# EasyEDA Pro project Padauk.eprj

# Schematic Schematic1
Board Name: Board1; Create Date: 2025-11-22; Page Name: P1; Project Name: PMS150C; Schematic Name: Schematic1; Update Date: 2025-11-22; Company: EasyEDA.com; Page Size: A4; Version: V1.0
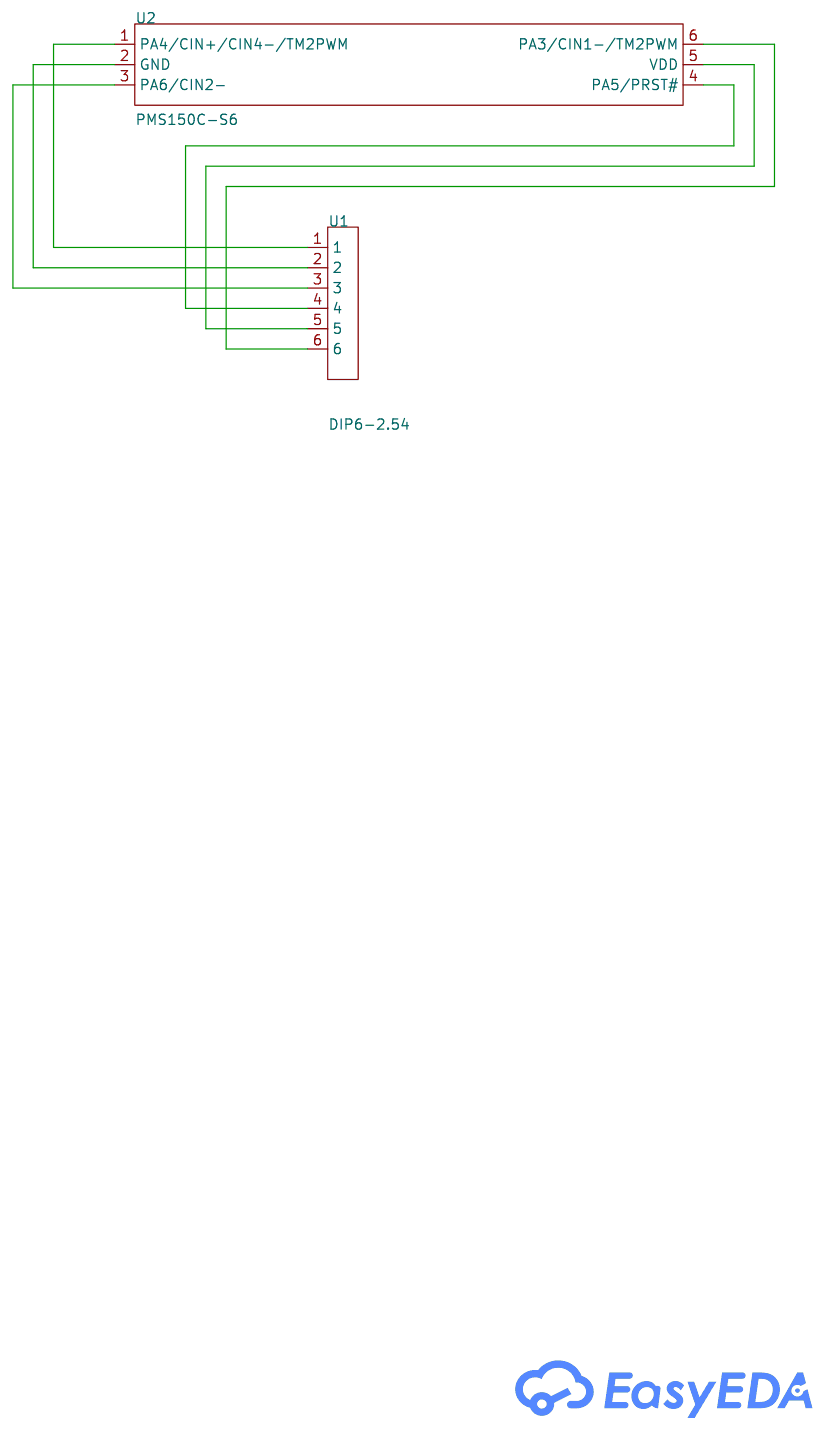
[diagram p0: schematic sheet]

## Parts
U1  DIP6-2.54  [SW-TH_L11.8-W10.3-P2.54_C9900008732]
U2  PMS150C-S6  [SOT-23-6_L2.9-W1.6-P0.95-LS2.8-TL]

## Library data of the parts
U1 = DIP6-2.54: Supplier Part: C9900008732; Supplier Footprint: SWDIP-4; JLCPCB Part Class: Extended Part; Supplier: LCSC
U2 = PMS150C-S6: Supplier Part: C9900003356; Supplier Footprint: SOT-23-6; JLCPCB Part Class: Extended Part; Supplier: LCSC

## Nets
$1N371: U1.1 U2.1(PA4/CIN+/CIN4-/TM2PWM)
$1N386: U1.2 U2.2(GND)
$1N393: U1.3 U2.3(PA6/CIN2-)
$1N419: U1.4 U2.4(PA5/PRST#)
$1N431: U1.5 U2.5(VDD)
$1N444: U1.6 U2.6(PA3/CIN1-/TM2PWM)

# Schematic Schematic2
Board Name: pfs154-s16-adapter; Create Date: 2025-12-14; Page Name: P1; Project Name: Padauk; Schematic Name: Schematic2; Update Date: 2025-12-14; Company: EasyEDA.com; Page Size: A4; Version: V1.0
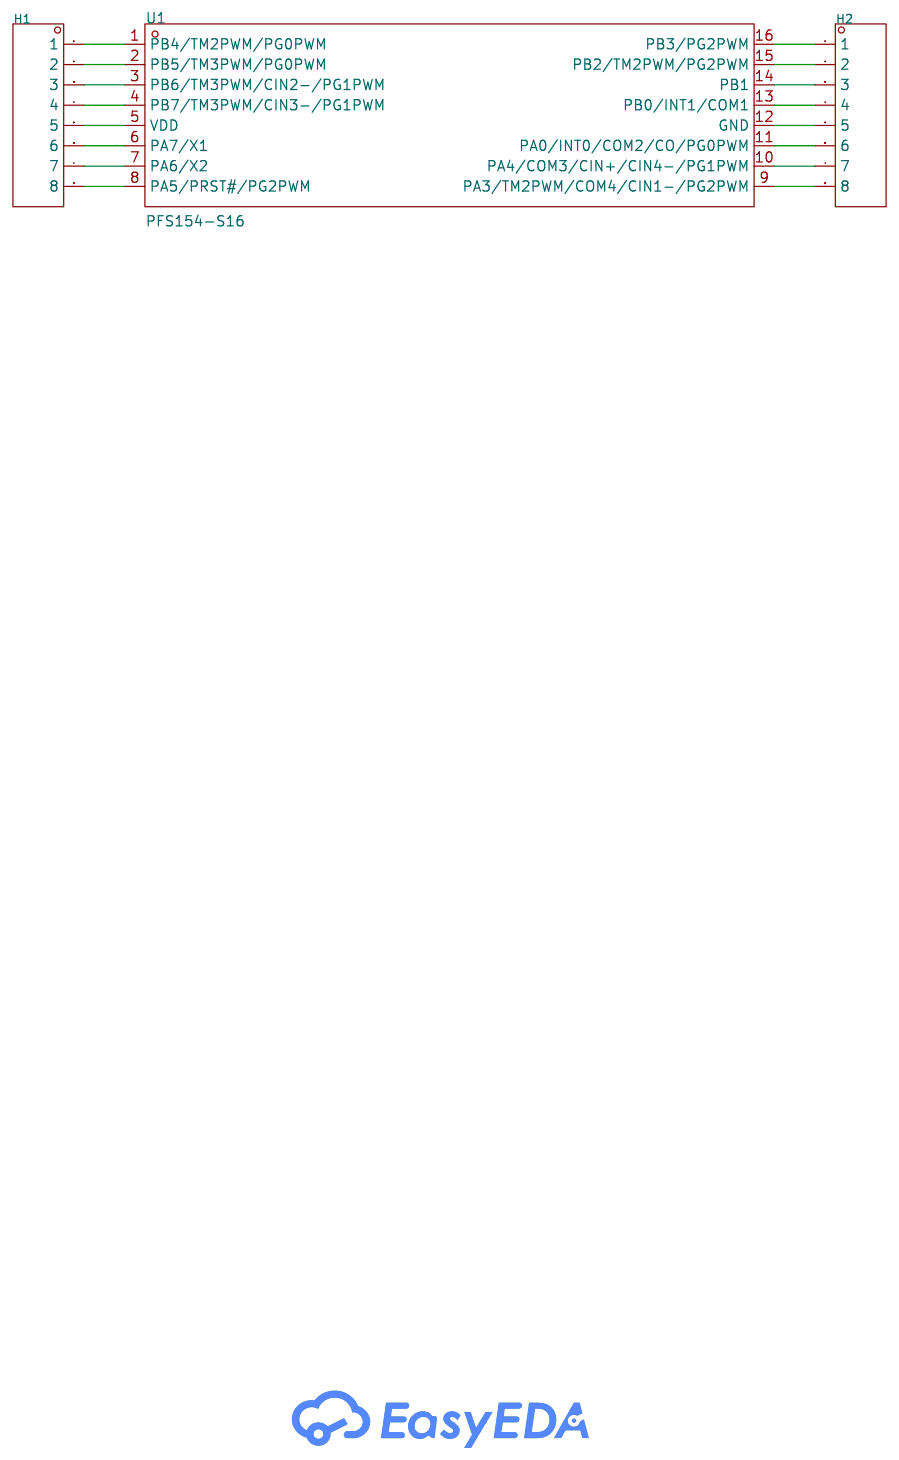
[diagram p1: schematic sheet]

## Parts
H1  -  [HDR-TH_8P-P2.54-V-M]
H2  -  [HDR-TH_8P-P2.54-V-M]
U1  PFS154-S16  [SOP-16_L10.0-W3.9-P1.27-LS6.0-BL]

## Library data of the parts
H1 H2 = HDR-M_2.54_1x8P: Supplier Footprint: Through
U1 = PFS154-S16: LCSC Part Name: 8位多次可编程（MTP）型IO控制器; Supplier Part: C317613; Manufacturer: PADAUK(应广); Supplier Footprint: SOP-16; JLCPCB Part Class: Extended Part; Datasheet: https://item.szlcsc.com/datasheet/PFS154-S16/299191.html; Supplier: LCSC; CPU Core: RISC; Program Storage Size: 2KB; Program Memory Type: FLASH; Number of I/O: 14; PWM (Bit): 11bit; Voltage - Supply: 2V~5.5V

## Nets
$1N503: H1.1 U1.1(PB4/TM2PWM/PG0PWM)
$1N507: H1.2 U1.2(PB5/TM3PWM/PG0PWM)
$1N512: H1.3 U1.3(PB6/TM3PWM/CIN2-/PG1PWM)
$1N517: H1.4 U1.4(PB7/TM3PWM/CIN3-/PG1PWM)
$1N522: H1.5 U1.5(VDD)
$1N527: H1.6 U1.6(PA7/X1)
$1N532: H1.7 U1.7(PA6/X2)
$1N537: H1.8 U1.8(PA5/PRST#/PG2PWM)
$1N542: H2.1 U1.16(PB3/PG2PWM)
$1N547: H2.2 U1.15(PB2/TM2PWM/PG2PWM)
$1N552: H2.3 U1.14(PB1)
$1N557: H2.4 U1.13(PB0/INT1/COM1)
$1N562: H2.5 U1.12(GND)
$1N567: H2.6 U1.11(PA0/INT0/COM2/CO/PG0PWM)
$1N572: H2.7 U1.10(PA4/COM3/CIN+/CIN4-/PG1PWM)
$1N577: H2.8 U1.9(PA3/TM2PWM/COM4/CIN1-/PG2PWM)

# Schematic Schematic3
Board Name: Dip8 Connector; Create Date: 2025-12-14; Page Name: P1; Project Name: Padauk; Schematic Name: Schematic3; Update Date: 2025-12-14; Company: EasyEDA.com; Page Size: A4; Version: V1.0
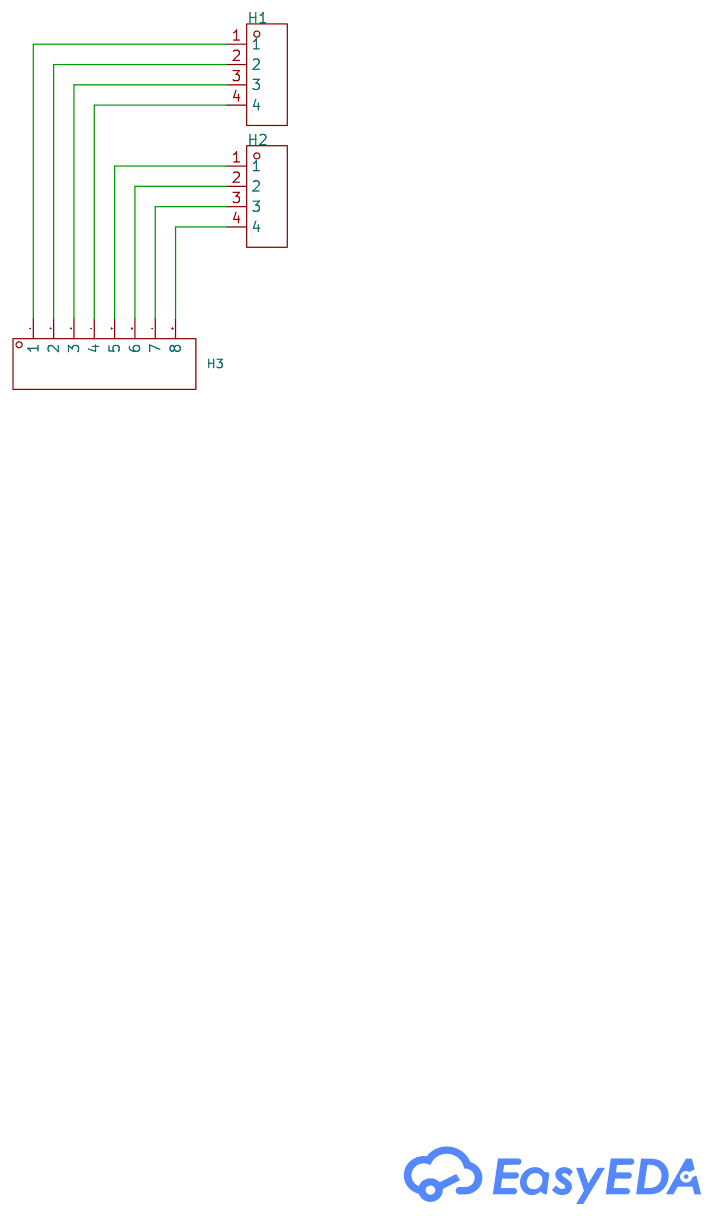
[diagram p2: schematic sheet]

## Parts
H1  -  [HDR-TH_4P-P2.54-V-M]
H2  -  [HDR-TH_4P-P2.54-V-M]
H3  -  [HDR-TH_8P-P2.54-V-M]

## Library data of the parts
H1 H2 = HDR-M_2.54_1x4P: Supplier Footprint: Through
H3 = HDR-M_2.54_1x8P: Supplier Footprint: Through

## Nets
$1N275: H2.1 H3.5
$1N280: H2.2 H3.6
$1N286: H2.3 H3.7
$1N292: H2.4 H3.8
$1N309: H1.1 H3.1
$1N314: H1.2 H3.2
$1N320: H1.3 H3.3
$1N326: H1.4 H3.4

# Schematic PDK Devboard V1
Board Name: PDK Devboard V1; Create Date: 2025-12-14; Page Name: P1; Project Name: Padauk; Schematic Name: PDK Devboard V1; Update Date: 2025-12-17; Company: m039; Drawn: Dmitry Mozgin; Page Size: A4; Version: V1.0
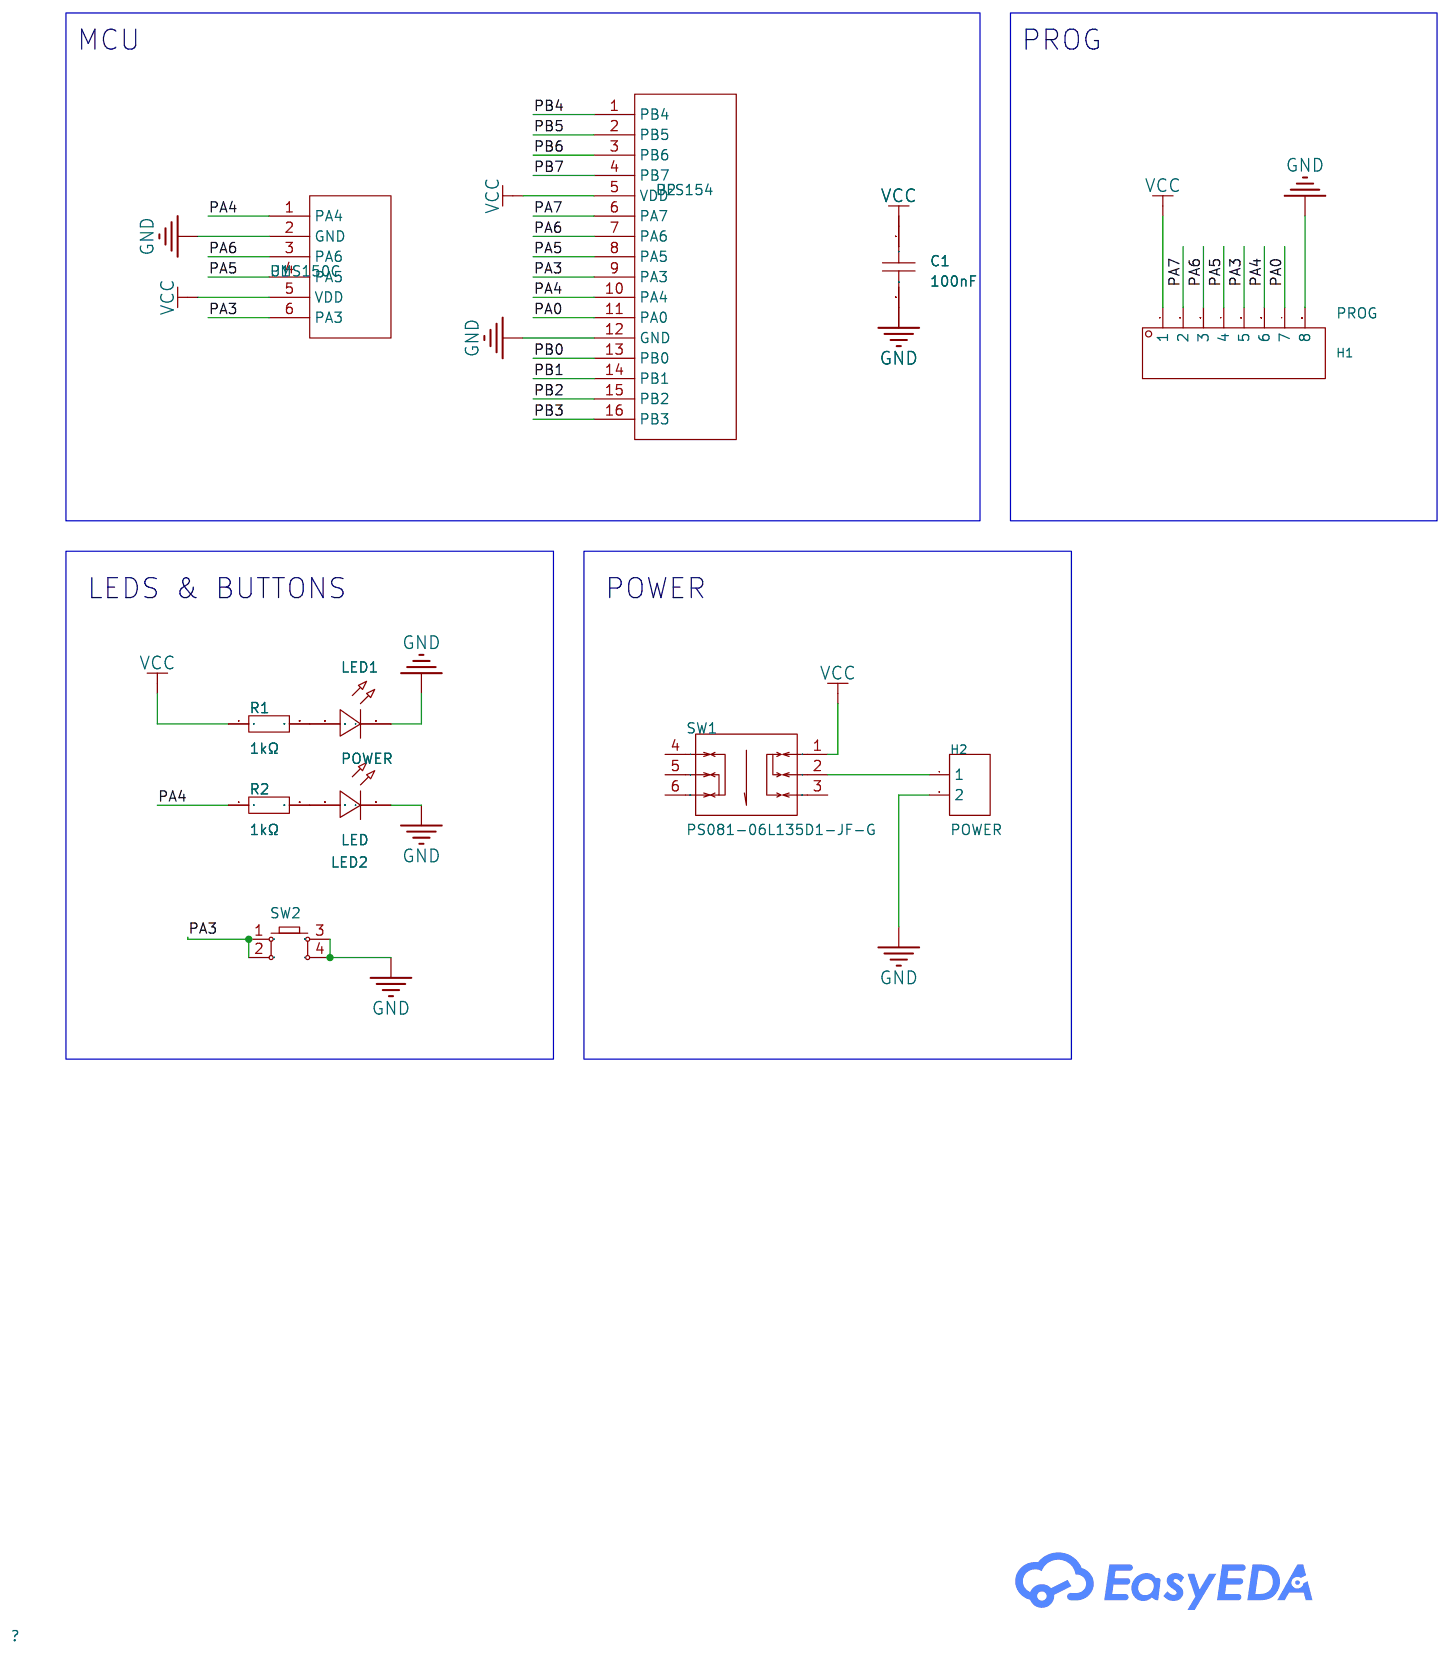
[diagram p3: schematic sheet]

## Parts
C1  100nF  [C0805]
H1  PROG  [HDR-TH_8P-P2.54-V-M]
H2  POWER  [HDR-TH_2P-P2.54-V-F]
LED1  POWER  [LED-TH_BD3.0-P2.54-FD]
LED2  LED  [LED-TH_BD3.0-P2.54-FD]
R1  1kΩ  [R1206]
R2  1kΩ  [R1206]
SW1  PS081-06L135D1-JF-G  [SW-TH_6P-L8.0-W8.0-P2.50-TL]
SW2  -  [KEY-TH_4P-L6.0-W6.0-P3.90-LS6.5]
U1  PMS150C  [PMS150C-U06]
U2  PFS154  [PFS154-S16-A]

## Library data of the parts
C1 = CAP_0805: Supplier Footprint: 0805
H1 = HDR-M_2.54_1x8P: Supplier Footprint: Through
H2 = HDR-F_2.54_1x2P: Supplier Footprint: Through
LED1 = LED_TH-R_3mm: Supplier Footprint: Through
LED2 = LED_TH-G_3mm: Supplier Footprint: Through
R1 R2 = Res_1206: Supplier Footprint: 1206
SW1 = PS081-06L135D1-JF-G: LCSC Part Name: 8x8自锁开关; Supplier Part: C46533676; Manufacturer: Khon(康宏电子); Supplier Footprint: DIP-6P,8x8mm; Datasheet: https://item.szlcsc.com/datasheet/PS081-06L135D1-JF-G/48661190.html; Supplier: LCSC
SW2 = Key_TH_6x6x4.5: Supplier Footprint: Through
U1 = PMS150C-U06
U2 = pfs154-s16-adapter

## Nets
GND: C1.2 H1.8 H2.2 LED1.2(A) LED2.2(A) SW2.3 SW2.4 U1.2(GND) U2.12(GND)
VCC: C1.1 H1.1 R1.1 SW1.1 U1.5(VDD) U2.5(VDD)
PA0: H1.7 U2.11(PA0)
PA3: H1.5 SW2.1 SW2.2 U1.6(PA3) U2.9(PA3)
PA4: H1.6 R2.1 U1.1(PA4) U2.10(PA4)
PA5: H1.4 U1.4(PA5) U2.8(PA5)
PA6: H1.3 U1.3(PA6) U2.7(PA6)
PA7: H1.2 U2.6(PA7)
PB0: U2.13(PB0)
PB1: U2.14(PB1)
PB2: U2.15(PB2)
PB3: U2.16(PB3)
PB4: U2.1(PB4)
PB5: U2.2(PB5)
PB6: U2.3(PB6)
PB7: U2.4(PB7)
$1N1002: LED1.1(C) R1.2
$1N1028: LED2.1(C) R2.2
$1N1956: H2.1 SW1.2

Not connected (* = marked no-connect by the designer): SW1 3 4 5 6

## Notes on the sheet
- MCU
- PROG
- LEDS & BUTTONS
- POWER

# Schematic Schematic5
Board Name: PDK Sound Player; Create Date: 2025-12-18; Page Name: P1; Project Name: Padauk; Schematic Name: Schematic5; Update Date: 2025-12-25; Company: m039; Drawn: Dmitry Mozgin; Page Size: A4; Version: V1.0
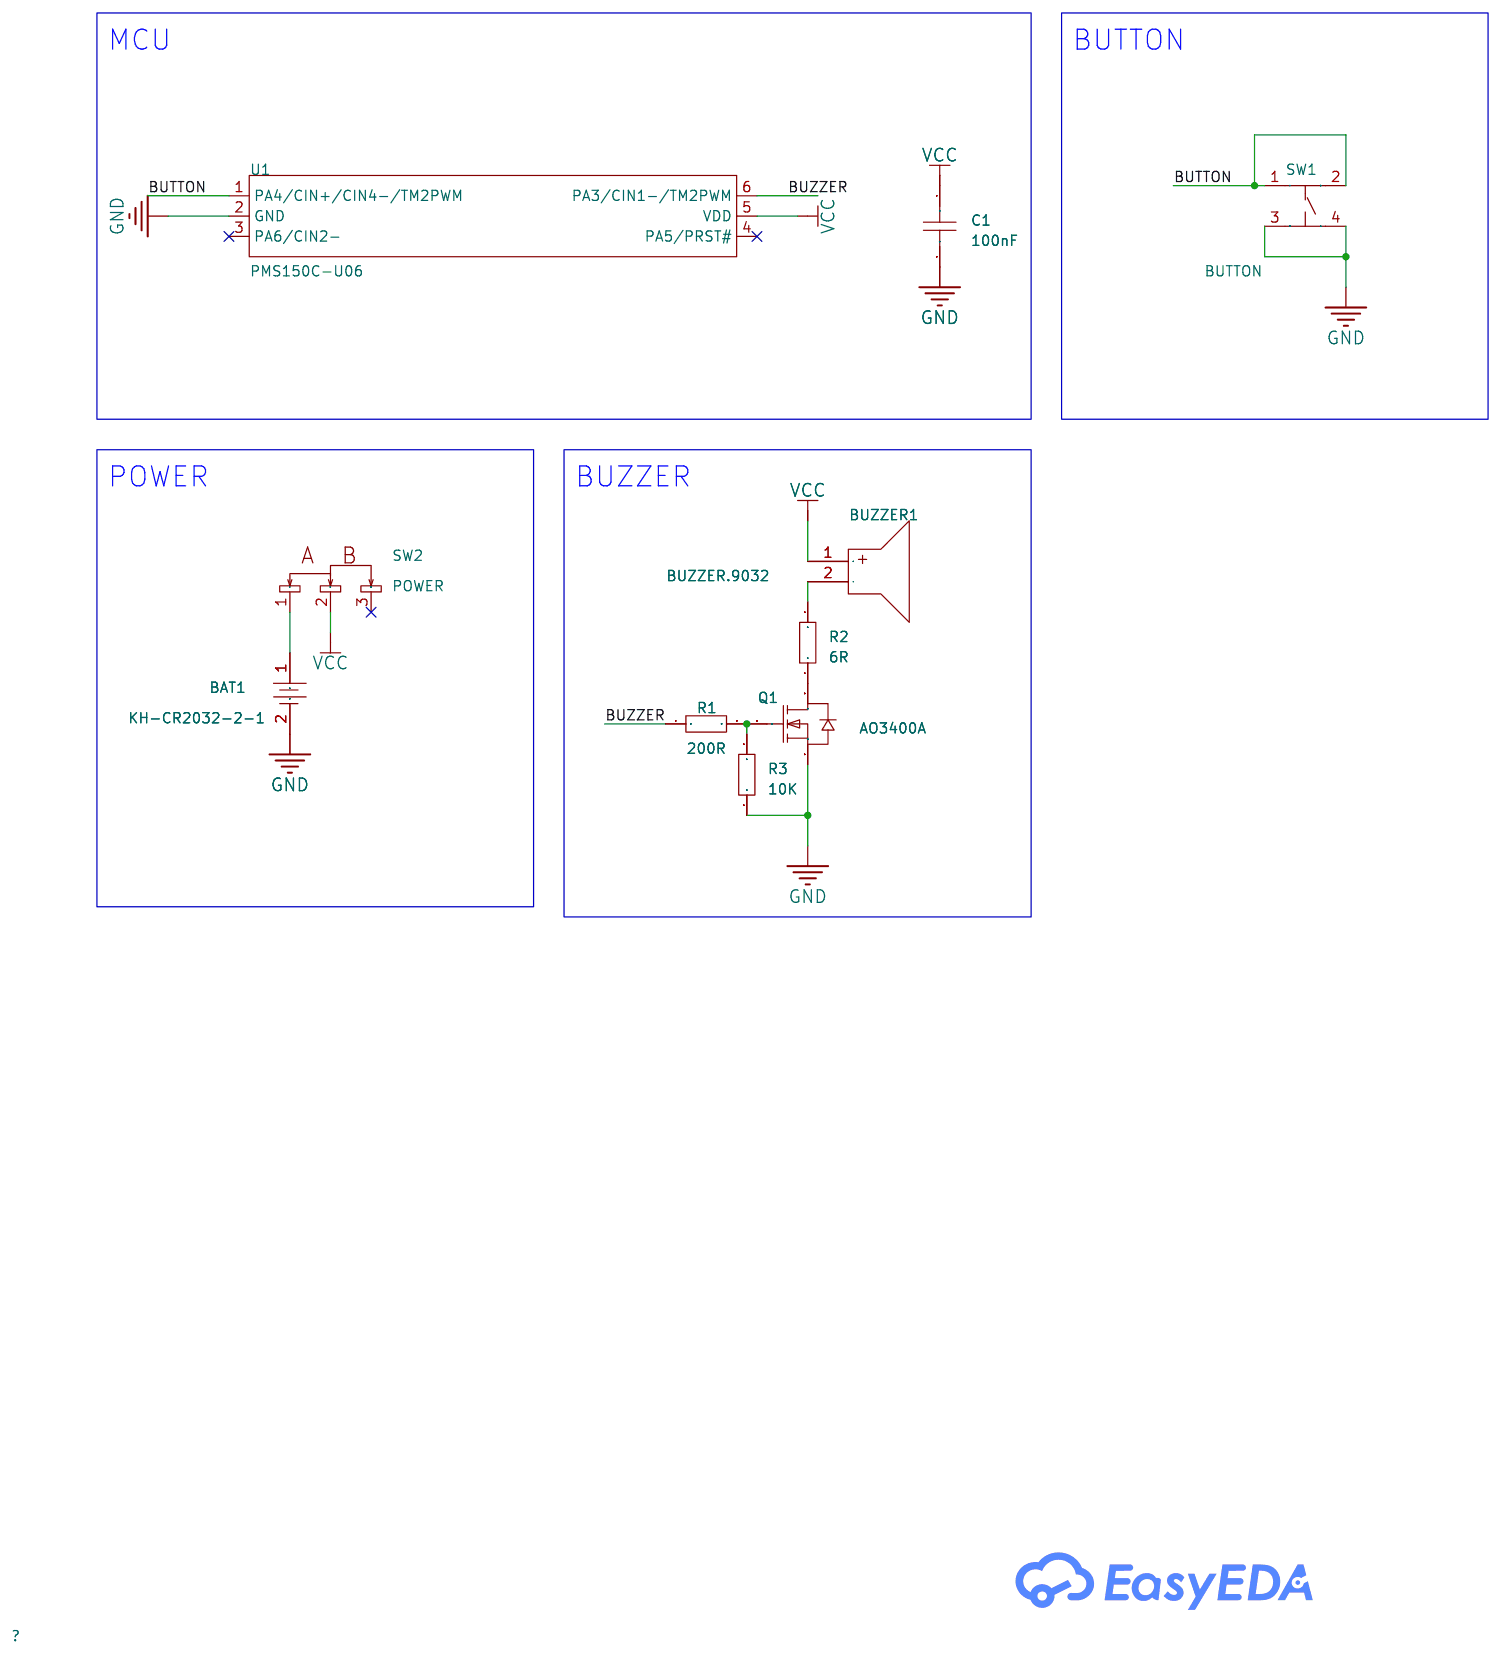
[diagram p4: schematic sheet]

## Parts
BAT1  KH-CR2032-2-1  [BAT-TH_KH-CR2032-2-1]
BUZZER1  BUZZER.9032  [BUZ-SMD_2P-L10.5-W9.0-P10.50-R]
C1  100nF  [C0603]
Q1  AO3400A  [SOT-23-3_L2.9-W1.3-P1.90-LS2.4-BR]
R1  200R  [R0603]
R2  6R  [R0603]
R3  10К  [R0603]
SW1  BUTTON  [SW-SMD_4P-L6.0-W6.0-P4.50-LS9.0_KH-6X6X6H-STM]
SW2  POWER  [MSS-22D18/MSS22D18]
U1  PMS150C-U06  [SOT-23-6_L2.9-W1.6-P0.95-LS2.8-BR]

## Library data of the parts
BAT1 = KH-CR2032-2-1: Supplier Part: C5365915; Manufacturer: kinghelm(金航标); JLCPCB Part Class: Extended Part; Datasheet: https://atta.szlcsc.com/upload/public/pdf/source/20230301/F3ED62C53898C1F99BC47B7A2E148BA2.pdf; Supplier: LCSC
BUZZER1 = BUZZER.9032: Supplier Part: C9900002564; Supplier Footprint: SMD; JLCPCB Part Class: Extended Part; Supplier: LCSC
C1 = CAP_0603: Supplier Footprint: 0603
Q1 = AO3400A_C20917: LCSC Part Name: 1个N沟道 耐压:30V 电流:5.7A; Supplier Part: C20917; Manufacturer: AOS; Supplier Footprint: SOT-23-3L; JLCPCB Part Class: Basic Part; Datasheet: https://item.szlcsc.com/datasheet/AO3400A/21629.html; Supplier: LCSC; Drain to Source Voltage: 30V; RDS(on): 48mΩ@2.5V; Gate Threshold Voltage (Vgs(th)): 1.45V@250uA; Gate Charge(Qg): 7nC@10V; Input Capacitance(Ciss): 630pF@15V; Operating Temperature: -55℃~+150℃@(Tj); Type: N-Channel
R1-R3 = Res_0603: Supplier Footprint: 0603
SW1 = KH-6X6X6H-STM: LCSC Part Name: 6*6*6mm 立贴 轻触开关; Supplier Part: C2837532; Manufacturer: kinghelm(金航标); Supplier Footprint: SMD-4P,6x6mm; JLCPCB Part Class: Extended Part; Datasheet: https://item.szlcsc.com/datasheet/KH-6X6X6H-STM/3009602.html; Supplier: LCSC; Circuit: SPST; Actuator Style: Round Button; Mounting Type: Surface Mount,Vertical; Length: 6mm; Width: 6mm; Switch Height: 6mm; with Bracket: Without Bracket; Contact Current: 50mA; Voltage Rating: 12V; Actuator/Cap Color: Black; Termination Style: Gull Wing; Life: 80,000 Cycles
SW2 = MSS22D18: Supplier Part: C9900190765; Supplier Footprint: 插件; JLCPCB Part Class: Extended Part; Supplier: LCSC
U1 = PMS150C-U06: LCSC Part Name: 8位一次性可编程（OTP）型IO控制器; Supplier Part: C168658; Manufacturer: PADAUK(应广); Supplier Footprint: SOT-23-6; JLCPCB Part Class: Extended Part; Datasheet: https://item.szlcsc.com/datasheet/PMS150C-U06/180041.html; Supplier: LCSC; CPU Core: RISC; Program Storage Size: 1KB; Program Memory Type: OTP; Voltage - Supply: 2V~5.5V

## Nets
GND: BAT1.2 C1.2 Q1.2(S) R3.1 SW1.3(C) SW1.4(D) U1.2(GND)
VCC: BUZZER1.1(+) C1.1 SW2.2 U1.5(VDD)
BUTTON: SW1.1(A) SW1.2(B) U1.1(PA4/CIN+/CIN4-/TM2PWM)
BUZZER: R1.1 U1.6(PA3/CIN1-/TM2PWM)
$1N702: Q1.1(G) R1.2 R3.2
$1N728: Q1.3(D) R2.1
$1N730: BUZZER1.2(-) R2.2
$1N951: BAT1.1 SW2.1

Not connected (* = marked no-connect by the designer): SW2 3*; U1 3(PA6/CIN2-)* 4(PA5/PRST#)*

## Notes on the sheet
- MCU
- BUTTON
- POWER
- BUZZER

# Schematic Schematic2_1
Board Name: pfs122-s16-adapter; Create Date: 2025-12-18; Page Name: P1; Project Name: Padauk; Schematic Name: Schematic2_1; Update Date: 2025-12-19; Company: EasyEDA.com; Page Size: A4; Version: V1.0
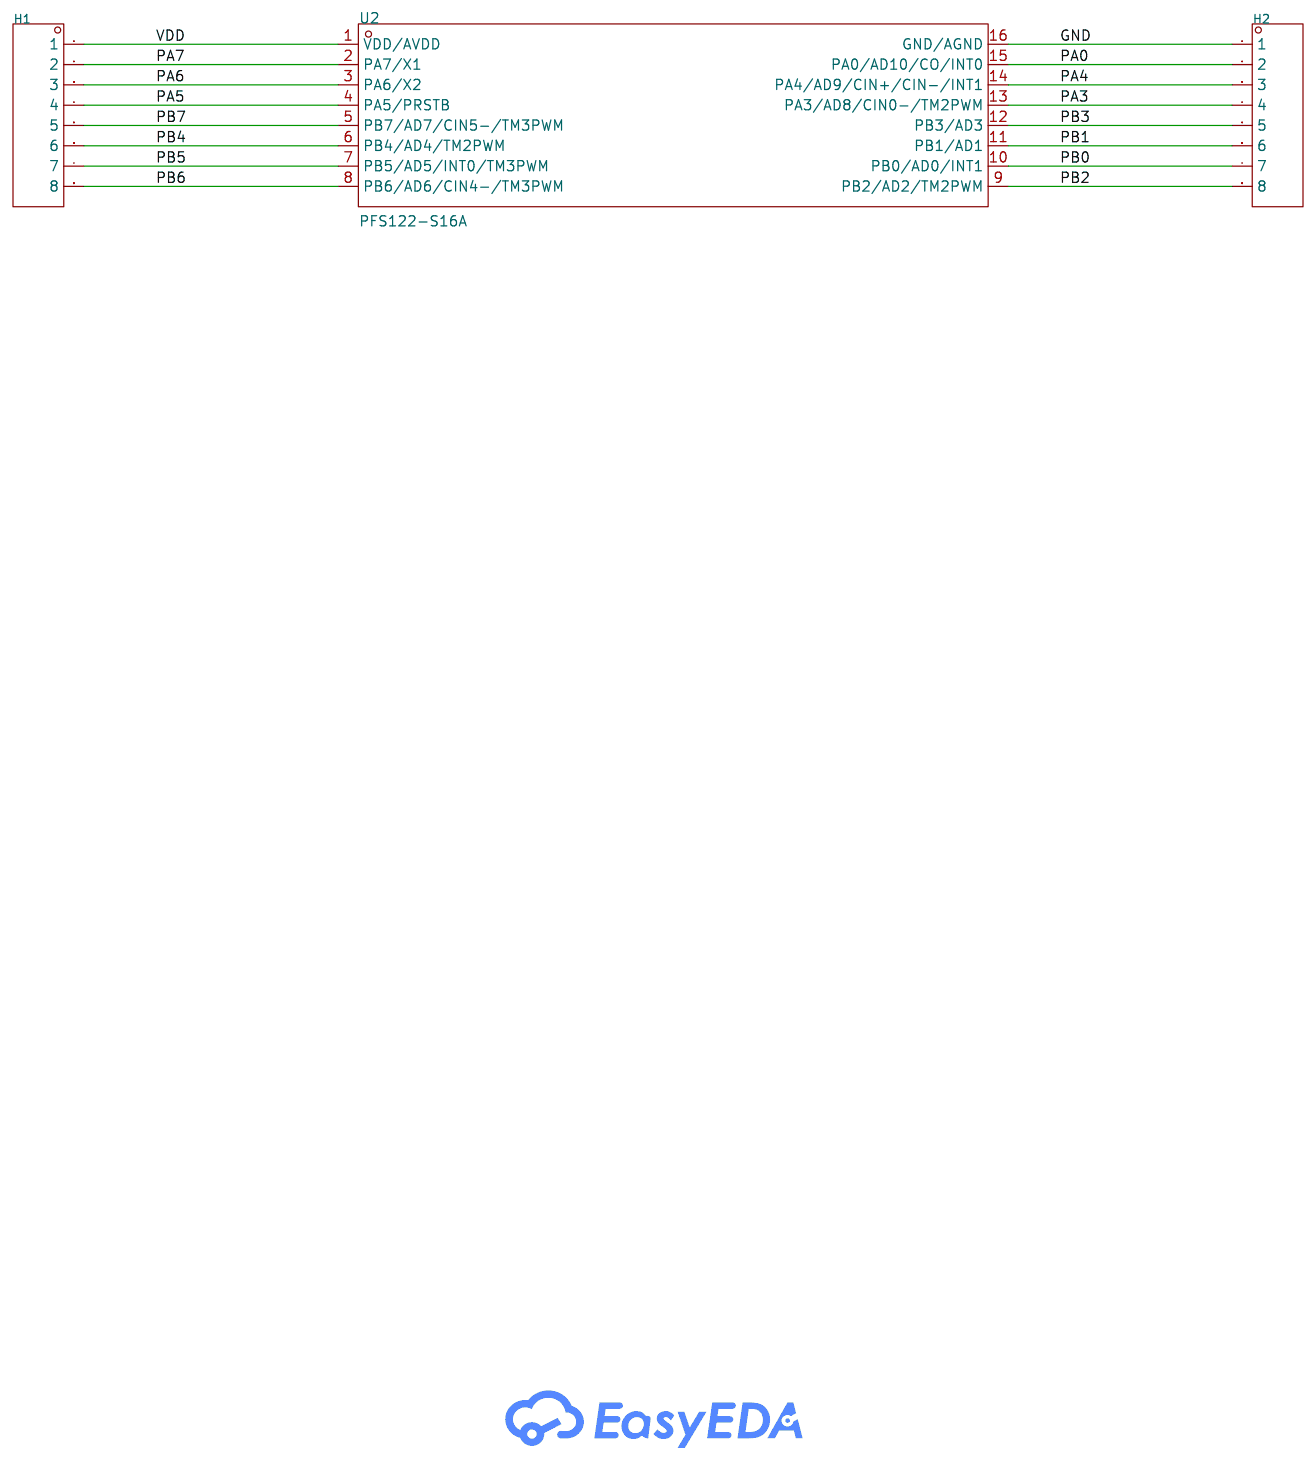
[diagram p5: schematic sheet]

## Parts
H1  -  [HDR-TH_8P-P2.54-V-M]
H2  -  [HDR-TH_8P-P2.54-V-M]
U2  PFS122-S16A  [SOIC-16_L9.9-W3.9-P1.27-LS6.0-BL]

## Library data of the parts
H1 H2 = HDR-M_2.54_1x8P: Supplier Footprint: Through
U2 = PFS122-S16A: Supplier Part: C3646912; Manufacturer: PADAUK(应广); Supplier Footprint: SOP-16-150mil; JLCPCB Part Class: Extended Part; Datasheet: https://atta.szlcsc.com/upload/public/pdf/source/20220825/C2F7EA01E0BE731B45B3F2DB09E17873.pdf; Supplier: LCSC

## Nets
GND: H2.1 U2.16(GND/AGND)
VDD: H1.1 U2.1(VDD/AVDD)
PA0: H2.2 U2.15(PA0/AD10/CO/INT0)
PA3: H2.4 U2.13(PA3/AD8/CIN0-/TM2PWM)
PA4: H2.3 U2.14(PA4/AD9/CIN+/CIN-/INT1)
PA5: H1.4 U2.4(PA5/PRSTB)
PA6: H1.3 U2.3(PA6/X2)
PA7: H1.2 U2.2(PA7/X1)
PB0: H2.7 U2.10(PB0/AD0/INT1)
PB1: H2.6 U2.11(PB1/AD1)
PB2: H2.8 U2.9(PB2/AD2/TM2PWM)
PB3: H2.5 U2.12(PB3/AD3)
PB4: H1.6 U2.6(PB4/AD4/TM2PWM)
PB5: H1.7 U2.7(PB5/AD5/INT0/TM3PWM)
PB6: H1.8 U2.8(PB6/AD6/CIN4-/TM3PWM)
PB7: H1.5 U2.5(PB7/AD7/CIN5-/TM3PWM)

# Board PCB1
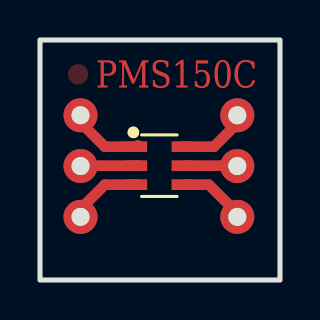
[diagram p6: board, top side]
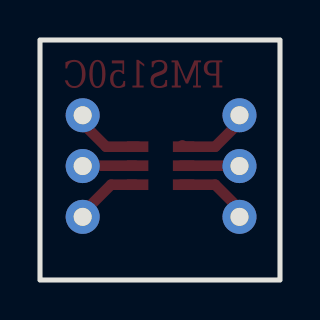
[diagram p7: board, bottom side, seen from below]

Outline 12 x 12 mm; copper layers: Top Layer, Bottom Layer. Coordinates in mm from the lower left corner of the outline.
Outline path: rectangle 0,12 12,0
Stack: Top Layer 0.035mm / Dielectric1 1.51mm FR4 er 4.5 / Bottom Layer 0.035mm

## Design rules (mm)
template: Custom Config
spacing copperThickness1oz (default): track to track 0.27, other pairs 0.152 to 0.3
spacing copperThickness2oz: track to track 0.203, other pairs 0.152 to 0.3
track width copperThickness1oz (default): min 0.127, default 0.532, max 2.54
track width copperThickness2oz: min 0.203, default 0.254, max 2.54
differential pair differentialPair (default): width min 0.127, default 0.254, max 2.54; gap min 0.152, default 0.152
via viaSize (default): diameter min 0.5, default 0.61, max 10; hole min 0.3, default 0.305, max 6.3

## Placement (name value [footprint] x y rotation side)
U1  DIP6-2.54  [SW-TH_L11.8-W10.3-P2.54_C9900008732]  5.84 5.59 0 top
U2  PMS150C-S6  [SOT-23-6_L2.9-W1.6-P0.95-LS2.8-TL]  5.97 5.72 0 top

## Footprints (pads in the part's own frame, mm; a bottom-side part is the same pattern mirrored in y, then rotated)
SOT-23-6_L2.9-W1.6-P0.95-LS2.8-TL
  rect 1.072x0.532 smd: 1(-1.149,0.95) 2(-1.149,0) 3(-1.149,-0.95) 4(1.149,-0.95) 5(1.149,0) 6(1.149,0.95)
SW-TH_L11.8-W10.3-P2.54_C9900008732
  round 1.7 hole 0.9: 1(-3.816,2.649) 2(-3.816,0.109) 3(-3.816,-2.431) 4(4.024,-2.431) 5(4.024,0.109) 6(4.024,2.649)

## Nets
As in the schematic.

## Routing (per net, layer and track width the routed paths; a pad name or vN(x,y) marks a point on that pad's centre or on a via; arc(x,y) is an arc through that point)
$1N371: length 3.7
  Top Layer w0.532: U1.1 2.03,7.88 3.24,6.67 U2.1 ; 4.88,6.73 4.95,6.67
$1N386: length 2.9
  Top Layer w0.532: 4.95,5.72 2.04,5.72 U1.2
$1N393: length 3.8
  Top Layer w0.532: U1.3 2.03,3.55 3.24,4.77 4.95,4.77
$1N419: length 3.4
  Top Layer w0.532: 7.25,4.77 8.44,4.77 9.87,3.34 U1.4
$1N431: length 2.6
  Top Layer w0.532: 7.25,5.72 9.85,5.72 U1.5
$1N444: length 3.6
  Top Layer w0.532: U2.6 8.7,6.67 9.87,7.83 U1.6

## Copper pours and planes (outline as drawn; the poured copper is in the pictures)
(no net) on Top Layer: 1.4,10.79 2.41,10.79 2.41,9.78 1.4,9.78

## Text on the board
Top Layer: PMS150C

# Board PCB2
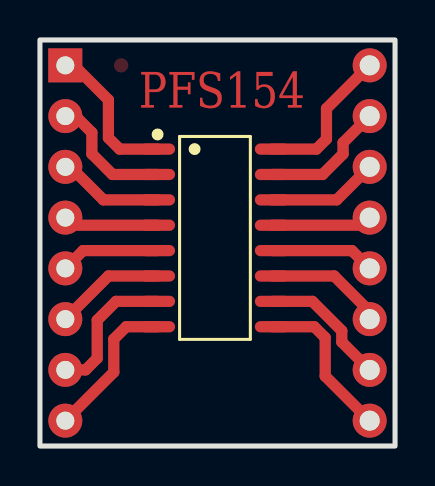
[diagram p8: board, top side]
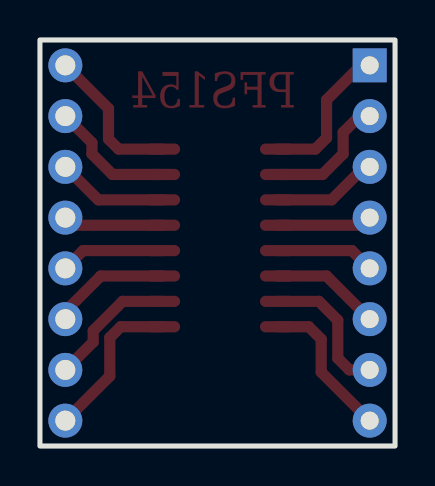
[diagram p9: board, bottom side, seen from below]

Outline 17.78 x 20.32 mm; copper layers: Top Layer, Bottom Layer. Coordinates in mm from the lower left corner of the outline.
Outline path: rectangle 0,20.32 17.78,0
Stack: Top Layer 0.035mm / Dielectric1 1.51mm FR4 er 4.5 / Bottom Layer 0.035mm

## Design rules (mm)
template: Custom Config
spacing copperThickness1oz (default): track to track 0.27, other pairs 0.152 to 0.3
spacing copperThickness2oz: track to track 0.203, other pairs 0.152 to 0.3
track width copperThickness1oz (default): min 0.127, default 0.56, max 2.54
track width copperThickness2oz: min 0.203, default 0.254, max 2.54
differential pair differentialPair (default): width min 0.127, default 0.254, max 2.54; gap min 0.152, default 0.152
via viaSize (default): diameter min 0.5, default 0.61, max 10; hole min 0.3, default 0.305, max 6.3

## Placement (name value [footprint] x y rotation side)
H1  -  [HDR-TH_8P-P2.54-V-M#2]  1.27 10.16 270 top
H2  -  [HDR-TH_8P-P2.54-V-M]  16.51 10.16 270 top
U1  PFS154-S16  [SOP-16_L10.0-W3.9-P1.27-LS6.0-BL]  8.76 10.41 270 top

## Footprints (pads in the part's own frame, mm; a bottom-side part is the same pattern mirrored in y, then rotated)
HDR-TH_8P-P2.54-V-M
  round 1.7 hole 1x0.9: 1(-8.89,0) 2(-6.35,0) 3(-3.81,0) 4(-1.27,0) 5(1.27,0) 6(3.81,0) 7(6.35,0) 8(8.89,0)
HDR-TH_8P-P2.54-V-M#2
  rect 1.7x1.7 hole 0.9: 1(-8.89,0)
  round 1.7 hole 0.9: 2(-6.35,0) 3(-3.81,0) 4(-1.27,0) 5(1.27,0) 6(3.81,0) 7(6.35,0) 8(8.89,0)
SOP-16_L10.0-W3.9-P1.27-LS6.0-BL
  oval 0.56x1.745 smd: 1(-4.445,-2.873) 2(-3.175,-2.873) 3(-1.905,-2.873) 4(-0.635,-2.873) 5(0.635,-2.873) 6(1.905,-2.873) 7(3.175,-2.873) 8(4.445,-2.873) 9(4.445,2.873) 10(3.175,2.873) 11(1.905,2.873) 12(0.635,2.873) 13(-0.635,2.873) 14(-1.905,2.873) 15(-3.175,2.873) 16(-4.445,2.873)

## Nets
As in the schematic.

## Routing (per net, layer and track width the routed paths; a pad name or vN(x,y) marks a point on that pad's centre or on a via; arc(x,y) is an arc through that point)
$1N503: length 7.5
  Top Layer w0.56: H1.1 1.7,19.05 3.43,17.32 3.43,15.42 3.99,14.86 U1.1
$1N507: length 6.5
  Top Layer w0.56: U1.2 3.63,13.59 2.6,14.62 2.6,15.69 1.78,16.51 H1.2
$1N512: length 5.3
  Top Layer w0.56: 1.27,13.97 1.52,13.97 3.17,12.32 U1.3
$1N517: length 4.8
  Top Layer w0.56: H1.4 1.65,11.05 U1.4
$1N522: length 5
  Top Layer w0.56: 1.27,8.89 2.16,9.78 U1.5
$1N527: length 5.5
  Top Layer w0.56: U1.6 3.43,8.51 H1.6
$1N532: length 7.2
  Top Layer w0.56: 1.27,3.81 2.29,3.81 2.87,4.39 2.87,6.3 3.81,7.24 U1.7
$1N537: length 7.5
  Top Layer w0.56: U1.8 4.32,5.97 3.7,5.35 3.7,3.7 H1.8
$1N542: length 7.5
  Top Layer w0.56: U1.16 13.84,14.86 14.35,15.36 14.35,16.89 H2.1
$1N547: length 6.4
  Top Layer w0.56: U1.15 14.15,13.59 15.18,14.62 15.18,15.18 H2.2
$1N552: length 5.6
  Top Layer w0.56: U1.14 14.86,12.32 16.51,13.97
$1N557: length 5
  Top Layer w0.56: U1.13 16.13,11.05 H2.4
$1N562: length 5.2
  Top Layer w0.56: 16.51,8.89 15.62,9.78 U1.12
$1N567: length 6
  Top Layer w0.56: H2.6 16.51,6.73 14.73,8.51 U1.11
$1N572: length 6.6
  Top Layer w0.56: U1.10 13.64,7.24 15.11,5.77 15.11,5.21 16.51,3.81
$1N577: length 7.9
  Top Layer w0.56: H2.8 14.28,3.5 14.28,5.42 13.74,5.97 U1.9

Small or netless copper shapes (teardrops, artwork), in the pictures only: 1 on Top Layer

## Text on the board
Top Layer: PFS154

# Board PCB3
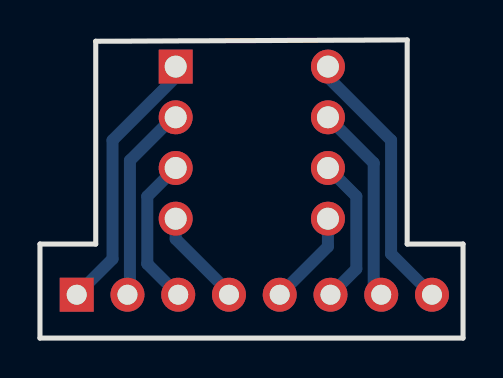
[diagram p10: board, top side]
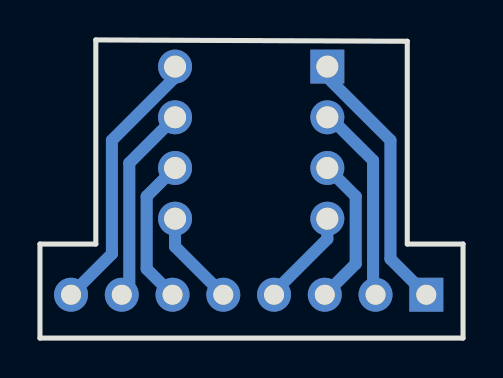
[diagram p11: board, bottom side, seen from below]

Outline 21.17 x 14.94 mm; copper layers: Top Layer, Bottom Layer. Coordinates in mm from the lower left corner of the outline.
Outline path: 0,4.71 0,0 21.17,0 21.17,4.71 18.38,4.71 18.38,14.94 2.79,14.87 2.79,4.71 0,4.71
Stack: Top Layer 0.035mm / Dielectric1 1.51mm FR4 er 4.5 / Bottom Layer 0.035mm

## Design rules (mm)
template: Custom Config
spacing copperThickness1oz (default): track to track 0.27, other pairs 0.152 to 0.3
spacing copperThickness2oz: track to track 0.203, other pairs 0.152 to 0.3
track width copperThickness1oz (default): min 0.127, default 0.6, max 2.54
track width copperThickness2oz: min 0.203, default 0.254, max 2.54
differential pair differentialPair (default): width min 0.127, default 0.254, max 2.54; gap min 0.152, default 0.152
via viaSize (default): diameter min 0.5, default 0.61, max 10; hole min 0.3, default 0.305, max 6.3

## Placement (name value [footprint] x y rotation side)
H1  -  [HDR-TH_4P-P2.54-V-M#2]  6.79 9.79 270 bottom
H2  -  [HDR-TH_4P-P2.54-V-M]  14.41 9.79 90 bottom
H3  -  [HDR-TH_8P-P2.54-V-M]  10.73 2.17 0 top

## Footprints (pads in the part's own frame, mm; a bottom-side part is the same pattern mirrored in y, then rotated)
HDR-TH_4P-P2.54-V-M
  round 1.7 hole 1.1x0.9: 1(-3.81,0) 2(-1.27,0) 3(1.27,0) 4(3.81,0)
HDR-TH_4P-P2.54-V-M#2
  rect 1.7x1.7 hole 1.1x0.9: 1(-3.81,0)
  round 1.7 hole 1.1x0.9: 2(-1.27,0) 3(1.27,0) 4(3.81,0)
HDR-TH_8P-P2.54-V-M
  rect 1.7x1.7 hole 1x0.9: 1(-8.89,0)
  round 1.7 hole 1x0.9: 2(-6.35,0) 3(-3.81,0) 4(-1.27,0) 5(1.27,0) 6(3.81,0) 7(6.35,0) 8(8.89,0)

## Nets
As in the schematic.

## Routing (per net, layer and track width the routed paths; a pad name or vN(x,y) marks a point on that pad's centre or on a via; arc(x,y) is an arc through that point)
$1N275: length 4.8
  Bottom Layer w0.6: H2.1 14.41,4.58 H3.5
$1N280: length 7.5
  Bottom Layer w0.6: H2.2 15.83,7.1 15.83,3.47 H3.6
$1N286: length 10
  Bottom Layer w0.6: H3.7 16.7,2.55 16.7,8.77 H2.3
$1N292: length 13.6
  Bottom Layer w0.6: H3.8 17.57,4.22 17.57,9.91 14.41,13.07 H2.4
$1N309: length 13.5
  Bottom Layer w0.6: H1.1 6.79,13.07 3.63,9.91 3.63,3.97 H3.1
$1N314: length 10
  Bottom Layer w0.6: H1.2 6.66,11.06 4.5,8.9 4.5,2.3 H3.2
$1N320: length 7.6
  Bottom Layer w0.6: H1.3 5.37,7.1 5.37,3.72 H3.3
$1N326: length 4.9
  Bottom Layer w0.6: H1.4 6.79,4.97 9.46,2.3 H3.4

# Board PCB4
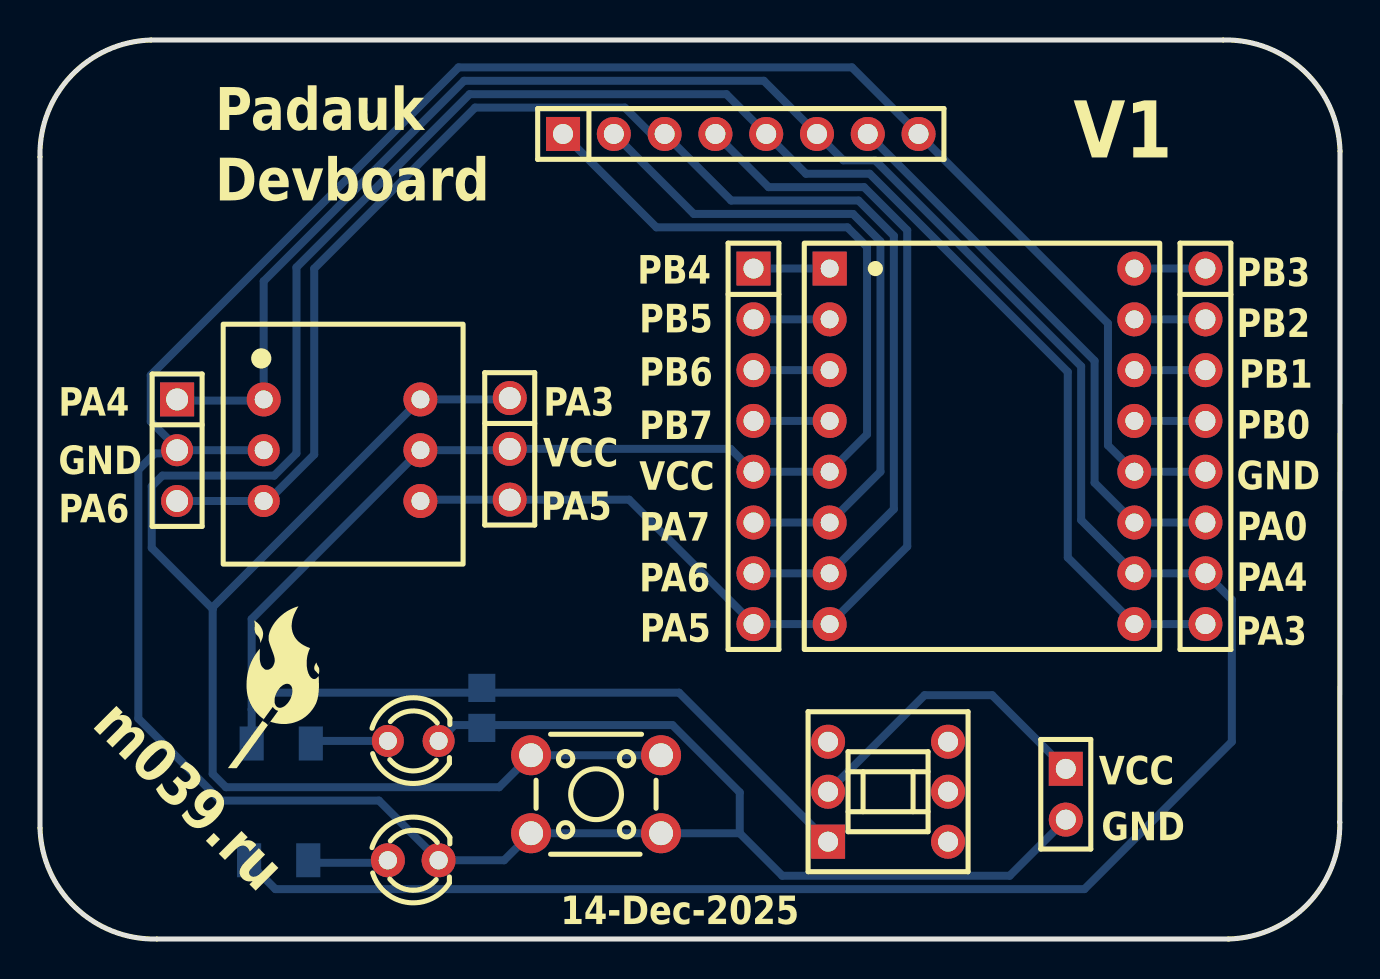
[diagram p12: board, top side]
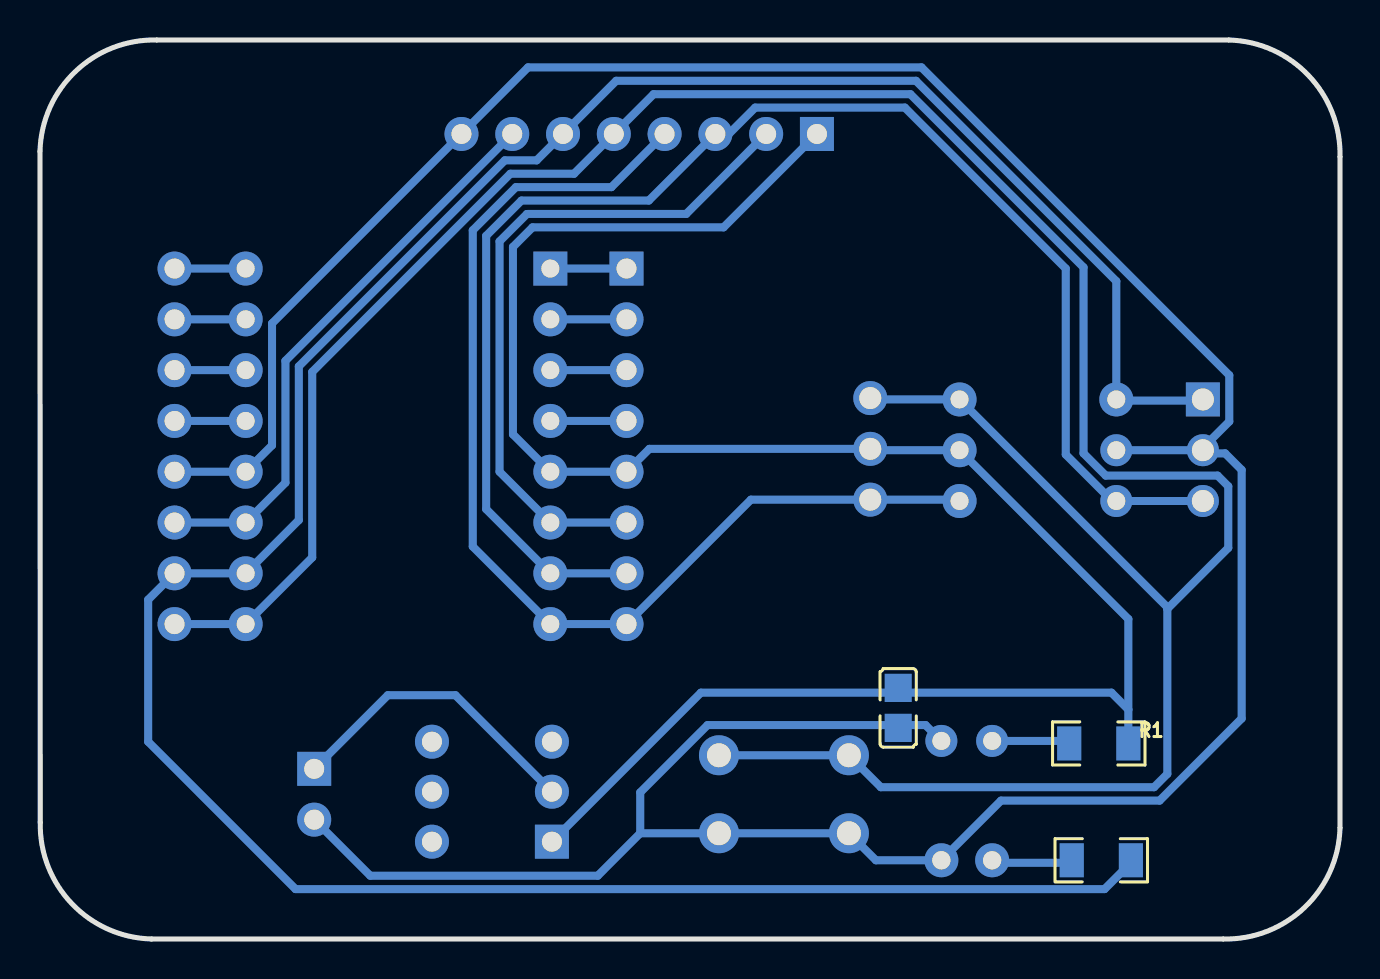
[diagram p13: board, bottom side, seen from below]

Outline 65.02 x 44.96 mm; copper layers: Top Layer, Bottom Layer. Coordinates in mm from the lower left corner of the outline.
Outline path: 0,39.12 0,5.56 arc(1.77,1.58) 5.84,0 59.45,0 arc(63.44,1.77) 65.01,5.84 65.02,39.4 arc(63.25,43.38) 59.18,44.96 5.56,44.96 arc(1.58,43.19) 0,39.12
Stack: Top Layer 0.035mm / Dielectric1 1.51mm FR4 er 4.5 / Bottom Layer 0.035mm

## Design rules (mm)
template: Custom Config
spacing copperThickness1oz (default): track to track 0.27, other pairs 0.152 to 0.3
spacing copperThickness2oz: track to track 0.203, other pairs 0.152 to 0.3
track width copperThickness1oz (default): min 0.127, default 0.4, max 2.54
track width copperThickness2oz: min 0.203, default 0.254, max 2.54
differential pair differentialPair (default): width min 0.127, default 0.254, max 2.54; gap min 0.152, default 0.152
via viaSize (default): diameter min 0.5, default 0.61, max 10; hole min 0.3, default 0.305, max 6.3

## Placement (name value [footprint] x y rotation side)
C1  100nF  [C0805]  22.1 11.56 270 bottom
H1  PROG  [HDR-TH_8P-P2.54-V-M]  35.05 40.26 0 top
H2  POWER  [HDR-TH_2P-P2.54-V-F]  51.31 7.24 270 top
H3  -  [HDR-TH_3P-P2.54-V-M]  6.86 24.44 270 top
H4  -  [HDR-TH_3P-P2.54-V-M#2]  23.5 24.51 270 top
H5  -  [HDR-TH_8P-P2.54-V-M]  35.69 24.64 270 top
H6  -  [HDR-TH_8P-P2.54-V-M#2]  58.29 24.64 270 top
LED1  POWER  [LED-TH_BD3.0-P2.54-FD]  18.67 9.91 0 top
LED2  LED  [LED-TH_BD3.0-P2.54-FD#2]  18.67 3.94 0 top
R1  1kΩ  [R1206]  12.07 9.78 0 bottom
R2  1kΩ  [R1206]  11.94 3.94 0 bottom
SW1  PS081-06L135D1-JF-G  [SW-TH_6P-L8.0-W8.0-P2.50-TL]  42.42 7.37 90 top
SW2  -  [KEY-TH_4P-L6.0-W6.0-P3.90-LS6.5]  27.81 7.24 0 top
U1  PMS150C  [PMS150C-U06]  15.11 24.51 0 top
U2  PFS154  [PFS154-S16-A]  46.99 24.77 0 top

## Footprints (pads in the part's own frame, mm; a bottom-side part is the same pattern mirrored in y, then rotated)
C0805
  rect 1.41x1.35 smd: 1(-1,0) 2(1,0)
HDR-TH_2P-P2.54-V-F
  rect 1.7x1.7 hole 1x0.9: 1(-1.27,0)
  round 1.7 hole 1x0.9: 2(1.27,0)
HDR-TH_3P-P2.54-V-M
  rect 1.7x1.7 hole 1.1x0.9: 1(-2.54,0)
  round 1.6 hole 1.1x0.9: 2(0,0) 3(2.54,0)
HDR-TH_3P-P2.54-V-M#2
  round 1.7 hole 1.1x0.9: 1(-2.54,0) 2(0,0) 3(2.54,0)
HDR-TH_8P-P2.54-V-M
  rect 1.7x1.7 hole 1x0.9: 1(-8.89,0)
  round 1.7 hole 1x0.9: 2(-6.35,0) 3(-3.81,0) 4(-1.27,0) 5(1.27,0) 6(3.81,0) 7(6.35,0) 8(8.89,0)
HDR-TH_8P-P2.54-V-M#2
  round 1.7 hole 1x0.9: 1(-8.89,0) 2(-6.35,0) 3(-3.81,0) 4(-1.27,0) 5(1.27,0) 6(3.81,0) 7(6.35,0) 8(8.89,0)
KEY-TH_4P-L6.0-W6.0-P3.90-LS6.5
  round 2 hole 1.2: 1(-3.25,1.95) 2(3.25,1.95) 3(-3.25,-1.95) 4(3.25,-1.95)
LED-TH_BD3.0-P2.54-FD
  round 1.6 hole 0.9: 1(-1.27,0) 2(1.27,0)
LED-TH_BD3.0-P2.54-FD#2
  round 1.7 hole 0.914x0.9: 1(-1.27,0) 2(1.27,0)
PFS154-S16-A
  rect 1.7x1.7 hole 0.9: 1(-7.493,8.763)
  round 1.7 hole 0.9: 2(-7.493,6.223) 3(-7.493,3.683) 4(-7.493,1.143) 5(-7.493,-1.397) 6(-7.493,-3.937) 7(-7.493,-6.477) 8(-7.493,-9.017) 9(7.747,-9.017) 10(7.747,-6.477) 11(7.747,-3.937) 12(7.747,-1.397) 13(7.747,1.143) 14(7.747,3.683) 15(7.747,6.223) 16(7.747,8.763)
PMS150C-U06
  round 1.7 hole 0.9: 1(-3.925,2.473) 4(3.916,-2.607) 5(3.916,-0.068) 6(3.916,2.473)
  round 1.6 hole 0.9: 2(-3.925,-0.068) 3(-3.925,-2.607)
R1206
  rect 1.208x1.701 smd: 1(-1.479,0) 2(1.479,0)
SW-TH_6P-L8.0-W8.0-P2.50-TL
  rect 1.7x1.7 hole 1x0.9: 1(-2.5,3)
  round 1.7 hole 1x0.9: 2(0,3) 3(2.5,3) 4(-2.5,-3) 5(0,-3) 6(2.5,-3)

## Nets
GND: C1.2 H1.8 H2.2 H3.2 H6.5 LED1.2 LED2.2 SW2.3 SW2.4 U1.2 U2.12
VCC: C1.1 H1.1 H4.2 H5.5 R1.1 SW1.1 U1.5 U2.5
PA0: H1.7 H6.6 U2.11
PA3: H1.5 H4.1 H6.8 SW2.1 SW2.2 U1.6 U2.9
PA4: H1.6 H3.1 H6.7 R2.1 U1.1 U2.10
PA5: H1.4 H4.3 H5.8 U1.4 U2.8
PA6: H1.3 H3.3 H5.7 U1.3 U2.7
PA7: H1.2 H5.6 U2.6
PB0: H6.4 U2.13
PB1: H6.3 U2.14
PB2: H6.2 U2.15
PB3: H6.1 U2.16
PB4: H5.1 U2.1
PB5: H5.2 U2.2
PB6: H5.3 U2.3
PB7: H5.4 U2.4
$1N1002: LED1.1 R1.2
$1N1028: LED2.1 R2.2
$1N1956: H2.1 SW1.2

Pads without a net: SW1 3 4 5 6

## Routing (per net, layer and track width the routed paths; a pad name or vN(x,y) marks a point on that pad's centre or on a via; arc(x,y) is an arc through that point)
GND: length 165.3
  Bottom Layer w0.4: H6.5 54.74,23.37 53.42,24.69 53.42,30.78 H1.8 40.61,43.59 20.93,43.59 5.54,28.19 5.54,25.88 6.86,24.56 6.86,24.38 ; 35,5.29 37.12,3.17 48.5,3.17 51.31,5.97 ; 35,5.29 35,7.33 31.63,10.7 20.73,10.7 LED1.2 ; 35,5.29 SW2.4 SW2.3 23.21,3.94 LED2.2 16.96,6.92 9.02,6.92 4.92,11.03 4.92,23.46 5.74,24.29 6.76,24.29 6.86,24.38 ; 6.86,24.38 6.92,24.44 U1.2
VCC: length 100.3
  Bottom Layer w0.4: 10.59,11.48 10.59,10.41 ; 10.59,11.48 11.43,12.32 31.97,12.32 SW1.1 ; 10.59,11.48 10.59,16 U1.5 23.43,24.44 H4.2 34.54,24.51 H5.5 U2.5 41.37,25.24 41.37,34.61 40.39,35.59 30.83,35.59 H1.1
PA0: length 28.5
  Bottom Layer w0.4: H1.7 52.75,28.91 52.75,22.82 54.74,20.83 H6.6
PA3: length 141
  Bottom Layer w0.4: H6.8 54.74,15.75 51.41,19.08 51.41,28.36 41.5,38.27 38.31,38.27 H1.5 34.33,42.25 21.49,42.25 12.83,33.59 12.83,24.29 11.71,23.17 6.12,23.17 5.59,22.64 5.59,19.56 8.64,16.51 ; H4.1 23.43,26.98 U1.6 8.64,16.59 8.64,16.51 ; SW2.2 SW2.1 22.97,7.59 9.3,7.59 8.64,8.26 8.64,16.51
PA4: length 138
  Bottom Layer w0.4: 10.46,3.81 11.77,2.5 52.24,2.5 59.61,9.87 59.61,16.97 H6.7 54.74,18.29 52.08,20.95 52.08,28.64 41.77,38.94 40.18,38.94 H1.6 36.2,42.92 21.21,42.92 11.19,32.9 U1.1 11.13,26.92 6.86,26.92
PA5: length 56
  Bottom Layer w0.4: H1.4 36.44,37.6 41.22,37.6 43.38,35.44 43.38,19.63 U2.8 H5.8 29.46,21.97 19.1,21.97 U1.4
PA6: length 74.1
  Bottom Layer w0.4: 6.86,21.84 6.92,21.9 U1.3 11.39,21.9 13.72,24.23 13.72,33.53 21.77,41.58 29.25,41.58 30.57,40.26 H1.3 34.57,36.93 40.94,36.93 42.71,35.16 42.71,21.5 U2.7 H5.7
PA7: length 34.5
  Bottom Layer w0.4: H1.2 32.7,36.26 40.67,36.26 42.04,34.89 42.04,23.37 U2.6 H5.6
PB0: length 3.6
  Bottom Layer w0.4: 54.74,25.91 H6.4
PB1: length 3.6
  Bottom Layer w0.4: 54.74,28.45 H6.3
PB2: length 3.6
  Bottom Layer w0.4: 54.74,30.99 H6.2
PB3: length 3.6
  Bottom Layer w0.4: 54.74,33.53 H6.1
PB4: length 3.8
  Bottom Layer w0.4: U2.1 H5.1
PB5: length 3.8
  Bottom Layer w0.4: U2.2 H5.2
PB6: length 3.8
  Bottom Layer w0.4: U2.3 H5.3
PB7: length 3.8
  Bottom Layer w0.4: U2.4 H5.4
$1N1002: length 3.9
  Bottom Layer w0.4: LED1.1 13.54,9.91
$1N1028: length 4
  Bottom Layer w0.4: 13.42,3.81 17.27,3.81 LED2.1
$1N1956: length 15.4
  Bottom Layer w0.4: H2.1 47.63,12.19 44.24,12.19 SW1.2

## Text on the board
Top Silkscreen Layer: PA4 | GND | PA6 | PA5 | VCC | PA3 | PB4 | PB5 | PB6 | PB7 | PA7 | PB3 | PB2 | PB0 | PA0 | PB1 | 14-Dec-2025 | Padauk / Devboard | m039.ru | V1

# Board PCB5
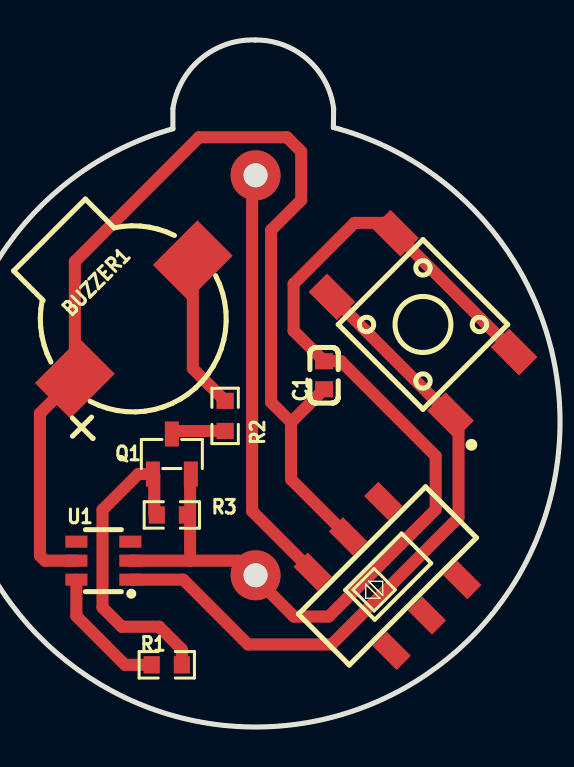
[diagram p14: board, top side]
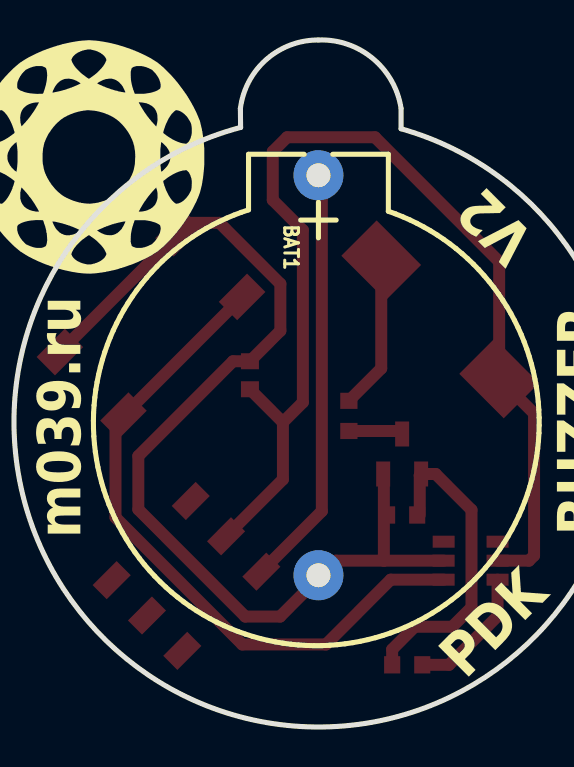
[diagram p15: board, bottom side, seen from below]

Outline 30.49 x 34.35 mm; copper layers: Top Layer, Bottom Layer. Coordinates in mm from the lower left corner of the outline.
Outline path: 11.11,30.92 11.11,29.91 arc(15.37,0) 19.14,29.98 19.16,30.92 arc(17.85,33.38) 15.25,34.35 arc(12.53,33.43) 11.11,30.92
Stack: Top Layer 0.035mm / Dielectric1 1.51mm FR4 er 4.5 / Bottom Layer 0.035mm

## Design rules (mm)
template: Custom Config
spacing copperThickness1oz (default): track to track 0.35, other pairs 0.152 to 0.41
spacing copperThickness2oz: track to track 0.203, other pairs 0.152 to 0.3
track width copperThickness1oz (default): min 0.127, default 0.6, max 2.54
track width copperThickness2oz: min 0.203, default 0.254, max 2.54
differential pair differentialPair (default): width min 0.127, default 0.254, max 2.54; gap min 0.152, default 0.152
via viaSize (default): diameter min 0.5, default 0.61, max 10; hole min 0.3, default 0.305, max 6.3

## Placement (name value [footprint] x y rotation side)
BAT1  KH-CR2032-2-1  [BAT-TH_KH-CR2032-2-1]  15.25 17.59 90 bottom
BUZZER1  BUZZER.9032  [BUZ-SMD_2P-L10.5-W9.0-P10.50-R]  9.15 20.38 225 top
C1  100nF  [C0603]  18.68 17.59 90 top
Q1  AO3400A  [SOT-23-3_L2.9-W1.3-P1.90-LS2.4-BR]  11.06 13.65 270 top
R1  200R  [R0603]  10.8 3.11 0 top
R2  6R  [R0603]  13.72 15.56 90 top
R3  10К  [R0603]  11.06 10.6 180 top
SW1  BUTTON  [SW-SMD_4P-L6.0-W6.0-P4.50-LS9.0_KH-6X6X6H-STM]  23.63 20.13 135 top
SW2  POWER  [MSS-22D18/MSS22D18]  21.85 7.55 45 top
U1  PMS150C-U06  [SOT-23-6_L2.9-W1.6-P0.95-LS2.8-BR]  7.63 8.32 0 top

## Footprints (pads in the part's own frame, mm; a bottom-side part is the same pattern mirrored in y, then rotated)
BAT-TH_KH-CR2032-2-1
  round 2.5 hole 1.2: 1(10,0) 2(-10,0)
BUZ-SMD_2P-L10.5-W9.0-P10.50-R
  rect 3.15x2.5 smd: 1(4.175,0) 2(-4.175,0)
C0603
  rect 0.8x0.9 smd: 1(-0.7,0) 2(0.7,0)
MSS-22D18/MSS22D18
  rect 1x1.7 smd: 1(-2.5,2.8) 2(0,2.8) 3(2.5,2.8) 4(-2.5,-2.8) 5(0,-2.8) 6(2.5,-2.8)
R0603
  rect 0.806x0.864 smd: 1(-0.753,0) 2(0.753,0)
SOT-23-3_L2.9-W1.3-P1.90-LS2.4-BR
  rect 1.25x0.7 smd: 1(1,-0.95) 2(1,0.95) 3(-1,0)
SOT-23-6_L2.9-W1.6-P0.95-LS2.8-BR
  rect 1.1x0.6 smd: 1(1.35,-0.95) 2(1.35,0) 3(1.35,0.95) 4(-1.35,0.95) 5(-1.35,0) 6(-1.35,-0.95)
SW-SMD_4P-L6.0-W6.0-P4.50-LS9.0_KH-6X6X6H-STM
  rect 2x1.3 smd: 1(-4.2,2.25) 2(4.2,2.25) 3(-4.2,-2.25) 4(4.2,-2.25)

## Nets
As in the schematic.

Pads without a net: SW2 3 4 5 6; U1 3 4

## Routing (per net, layer and track width the routed paths; a pad name or vN(x,y) marks a point on that pad's centre or on a via; arc(x,y) is an arc through that point)
GND: length 52.7
  Top Layer w0.6: 11.97,8.32 14.37,8.32 17.17,5.52 18.91,5.52 24.26,10.88 24.26,13.55 19.52,18.29 C1.2 17.15,19.81 17.15,22.16 20.2,25.21 21.73,25.21 SW1.4 28.19,18.75 ; 11.97,8.32 11.97,12.61 Q1.2 ; 11.97,8.32 U1.2
VCC: length 54.9
  Top Layer w0.6: 17.03,15.24 17.03,12.38 19.87,9.53 ; 17.03,15.24 16.03,16.23 16.03,24.84 17.53,26.35 17.53,28.77 16.82,29.49 12.42,29.49 6.2,23.27 6.2,17.93 ; 17.03,15.24 C1.1 ; 6.2,17.43 4.45,15.68 4.45,8.57 4.71,8.32 6.28,8.32
BUTTON: length 34.1
  Top Layer w0.6: U1.1 11.63,7.37 14.87,4.13 19.06,4.13 25.41,10.48 25.41,15.17 SW1.1 19.07,21.51
BUZZER: length 6.6
  Top Layer w0.6: R1.1 8.71,3.11 6.28,5.54 6.28,7.37
$1N702: length 15.8
  Top Layer w0.6: 10.18,10.6 10.18,12.58 Q1.1 9.38,12.65 7.58,10.86 7.58,5.98 8.55,5.01 10.42,5.01 11.56,3.88 R1.2
$1N728: length 2.7
  Top Layer w0.6: Q1.3 11.21,14.8 R2.1
$1N730: length 7.7
  Top Layer w0.6: R2.2 12.1,17.93 BUZZER1.2
$1N951: length 21.9
  Top Layer w0.6: 14.99,28.35 15.08,28.27 15.08,10.79 SW2.1

## Text on the board
Bottom Silkscreen Layer: PDK | BUZZER | V2 | m039.ru

# Board PCB2_1
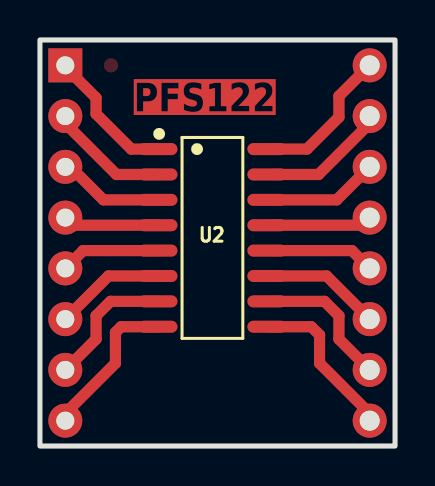
[diagram p16: board, top side]
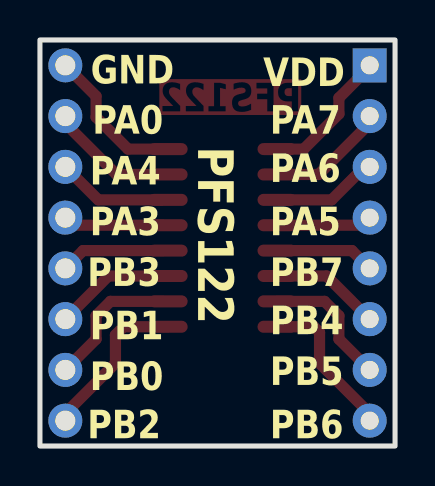
[diagram p17: board, bottom side, seen from below]

Outline 17.78 x 20.32 mm; copper layers: Top Layer, Bottom Layer. Coordinates in mm from the lower left corner of the outline.
Outline path: rectangle 0,20.32 17.78,0
Stack: Top Layer 0.035mm / Dielectric1 1.51mm FR4 er 4.5 / Bottom Layer 0.035mm

## Design rules (mm)
template: Custom Config
spacing copperThickness1oz (default): track to track 0.41, other pairs 0.152 to 0.41
spacing copperThickness2oz: track to track 0.203, other pairs 0.152 to 0.3
track width copperThickness1oz (default): min 0.127, default 0.56, max 2.54
track width copperThickness2oz: min 0.203, default 0.254, max 2.54
differential pair differentialPair (default): width min 0.127, default 0.254, max 2.54; gap min 0.152, default 0.152
via viaSize (default): diameter min 0.5, default 0.61, max 10; hole min 0.3, default 0.305, max 6.3

## Placement (name value [footprint] x y rotation side)
H1  -  [HDR-TH_8P-P2.54-V-M#2]  1.27 10.16 270 top
H2  -  [HDR-TH_8P-P2.54-V-M]  16.51 10.16 270 top
U2  PFS122-S16A  [SOIC-16_L9.9-W3.9-P1.27-LS6.0-BL]  8.64 10.41 270 top

## Footprints (pads in the part's own frame, mm; a bottom-side part is the same pattern mirrored in y, then rotated)
HDR-TH_8P-P2.54-V-M
  round 1.7 hole 1x0.9: 1(-8.89,0) 2(-6.35,0) 3(-3.81,0) 4(-1.27,0) 5(1.27,0) 6(3.81,0) 7(6.35,0) 8(8.89,0)
HDR-TH_8P-P2.54-V-M#2
  rect 1.7x1.7 hole 0.9: 1(-8.89,0)
  round 1.7 hole 0.9: 2(-6.35,0) 3(-3.81,0) 4(-1.27,0) 5(1.27,0) 6(3.81,0) 7(6.35,0) 8(8.89,0)
SOIC-16_L9.9-W3.9-P1.27-LS6.0-BL
  oval 0.602x1.971 smd: 1(-4.445,-2.736) 2(-3.175,-2.736) 3(-1.905,-2.736) 4(-0.635,-2.736) 5(0.635,-2.736) 6(1.905,-2.736) 7(3.175,-2.736) 8(4.445,-2.736) 9(4.445,2.736) 10(3.175,2.736) 11(1.905,2.736) 12(0.635,2.736) 13(-0.635,2.736) 14(-1.905,2.736) 15(-3.175,2.736) 16(-4.445,2.736)

## Nets
As in the schematic.

## Routing (per net, layer and track width the routed paths; a pad name or vN(x,y) marks a point on that pad's centre or on a via; arc(x,y) is an arc through that point)
GND: length 7.2
  Top Layer w0.56: H2.1 14.97,17.51 14.97,16.46 13.37,14.86 11.64,14.86
VDD: length 6.9
  Top Layer w0.56: H1.1 1.27,18.96 2.81,17.42 2.81,16.62 4.57,14.86 5.89,14.86
PA0: length 6.3
  Top Layer w0.56: H2.2 16.51,16.15 13.95,13.59 11.64,13.59
PA3: length 5
  Top Layer w0.56: H2.4 16.13,11.05 11.64,11.05
PA4: length 5.6
  Top Layer w0.56: 16.51,13.97 14.86,12.32 11.64,12.32
PA5: length 4.8
  Top Layer w0.56: 5.89,11.05 1.65,11.05 H1.4
PA6: length 5.3
  Top Layer w0.56: 1.27,13.97 1.52,13.97 3.17,12.32 5.89,12.32
PA7: length 6
  Top Layer w0.56: 5.89,13.59 3.83,13.59 1.27,16.15 H1.2
PB0: length 7
  Top Layer w0.56: 16.51,3.81 14.97,5.35 14.97,6.52 14.25,7.24 11.64,7.24
PB1: length 5.8
  Top Layer w0.56: 11.64,8.51 14.35,8.51 H2.6
PB2: length 8.1
  Top Layer w0.56: U2.9 13.59,5.97 14,5.56 14,4.14 16.51,1.63 H2.8
PB3: length 5.2
  Top Layer w0.56: 11.64,9.78 15.62,9.78 16.51,8.89
PB4: length 5.5
  Top Layer w0.56: H1.6 3.43,8.51 5.89,8.51
PB5: length 6.7
  Top Layer w0.56: 5.89,7.24 3.53,7.24 2.81,6.52 2.81,5.35 1.27,3.81
PB6: length 7.7
  Top Layer w0.56: H1.8 1.27,1.63 3.78,4.14 3.78,5.69 4.06,5.97 U2.8
PB7: length 5
  Top Layer w0.56: 5.89,9.78 2.16,9.78 1.27,8.89

Small or netless copper shapes (teardrops, artwork), in the pictures only: 1 on Top Layer

## Text on the board
Bottom Silkscreen Layer: PA7 | PA6 | PA5 | PB7 | PB4 | PB5 | PB6 | VDD | PA0 | GND | PA4 | PA3 | PB1 | PB0 | PB3 | PB2 | PFS122
Top Layer: PFS122
